# EAGLE design TQFP-100_to_breadboard-100 (EAGLE 8.5.1)
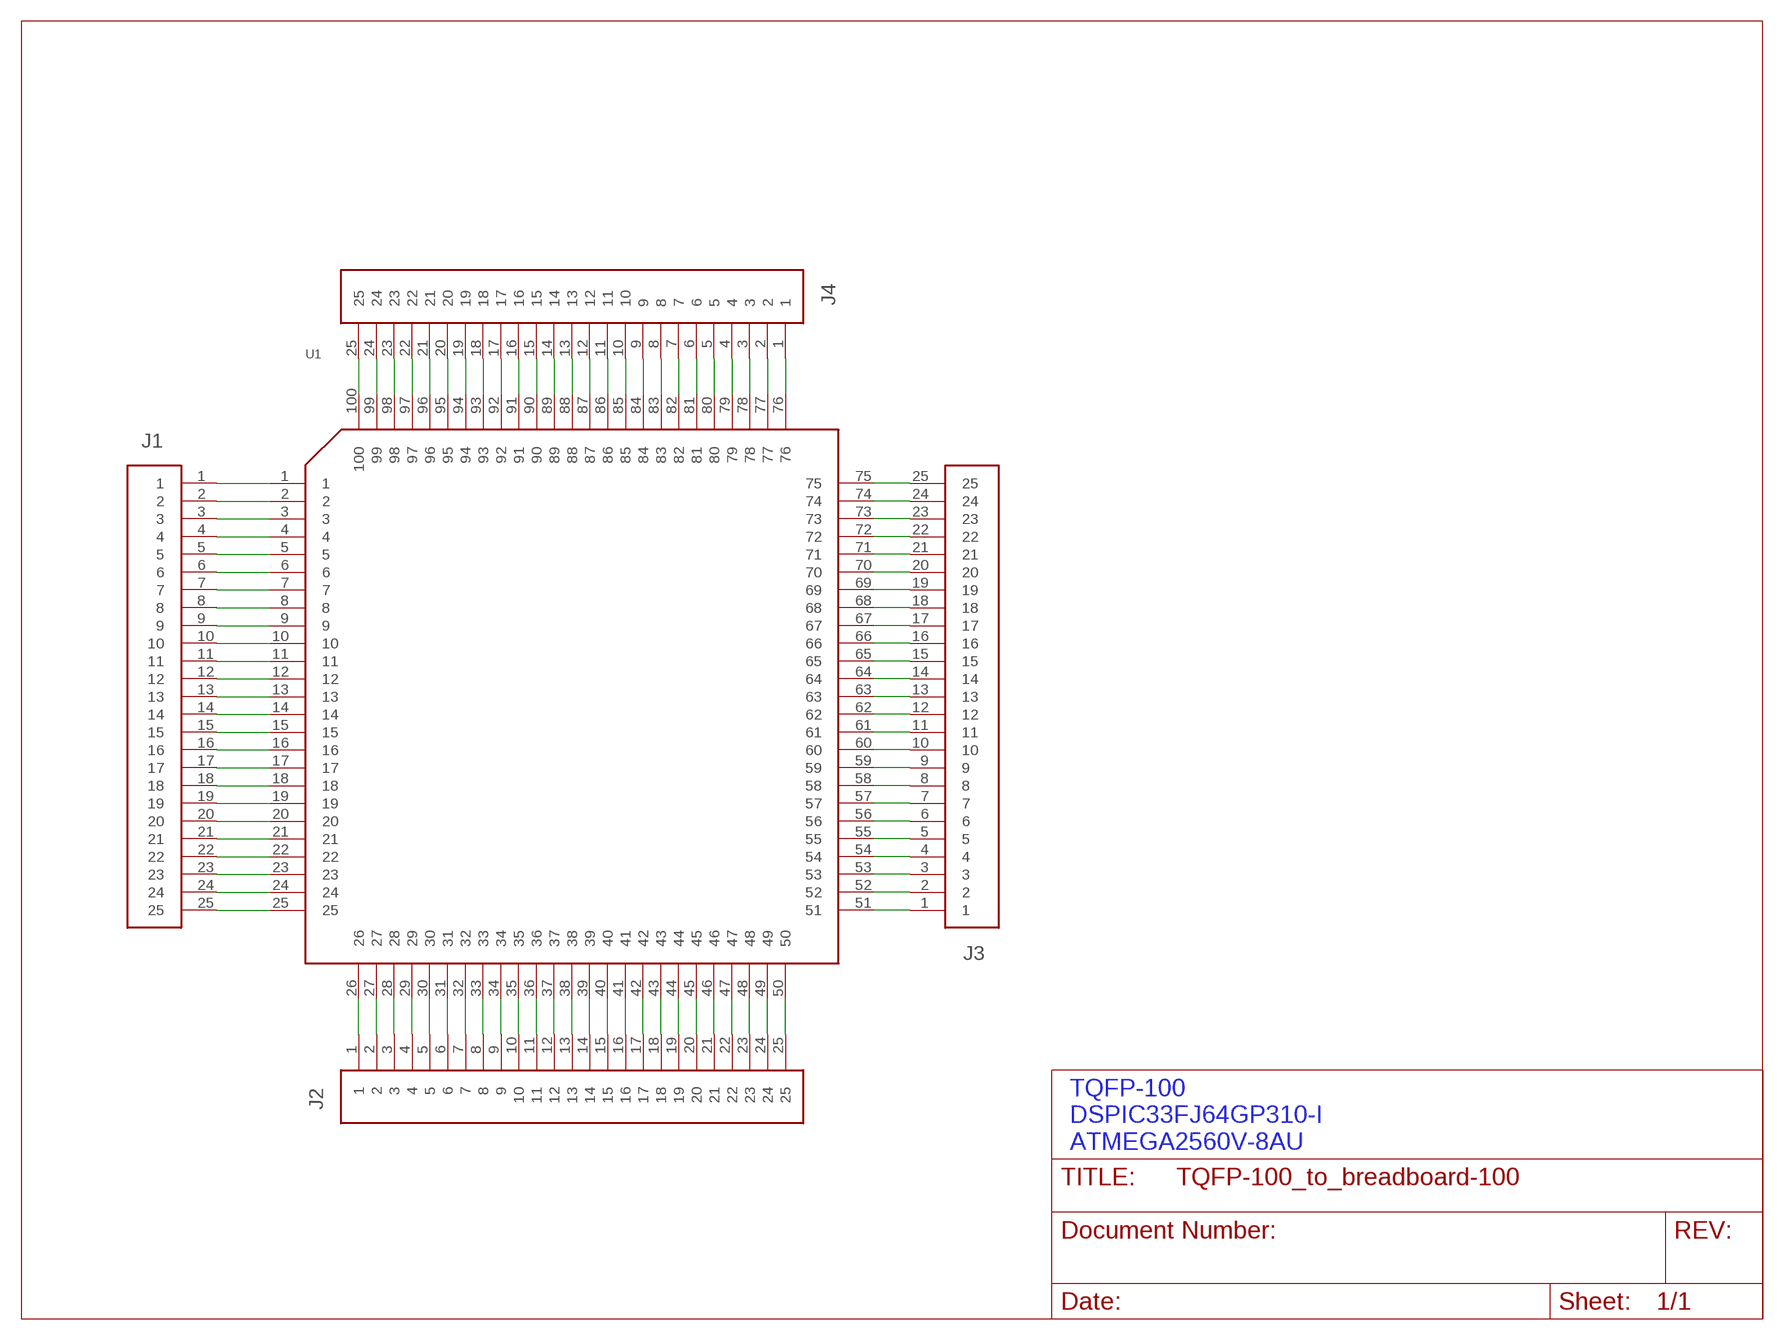
[diagram p0: schematic, sheet 1]

## Parts
J1  CONNECTOR_25  [68000-125HLF]
J2  CONNECTOR_25_NO_SQUARE  [68000-125HLF_NO_SQUARE]
J3  CONNECTOR_25_NO_SQUARE  [68000-125HLF_NO_SQUARE]
J4  CONNECTOR_25_NO_SQUARE  [68000-125HLF_NO_SQUARE]
U1  IC-GENERIC-100-TQFP  [QFP40P1400X1400X120-100N]

## Nets
N$1: J1.1 U1.1
N$2: J1.2 U1.2
N$3: J1.3 U1.3
N$4: J1.4 U1.4
N$5: J1.5 U1.5
N$6: J1.6 U1.6
N$7: J1.7 U1.7
N$8: J1.8 U1.8
N$9: J1.9 U1.9
N$10: J1.10 U1.10
N$11: J1.11 U1.11
N$12: J1.12 U1.12
N$13: J1.13 U1.13
N$14: J1.14 U1.14
N$15: J1.15 U1.15
N$16: J1.16 U1.16
N$17: J1.17 U1.17
N$18: J1.18 U1.18
N$19: J1.19 U1.19
N$20: J1.20 U1.20
N$21: J1.21 U1.21
N$22: J1.22 U1.22
N$23: J1.23 U1.23
N$24: J1.24 U1.24
N$25: J1.25 U1.25
N$26: J2.1 U1.26
N$27: J2.2 U1.27
N$28: J2.3 U1.28
N$29: J2.4 U1.29
N$30: J2.5 U1.30
N$31: J2.6 U1.31
N$32: J2.7 U1.32
N$33: J2.8 U1.33
N$34: J2.9 U1.34
N$35: J2.10 U1.35
N$36: J2.11 U1.36
N$37: J2.12 U1.37
N$38: J2.13 U1.38
N$39: J2.14 U1.39
N$40: J2.15 U1.40
N$41: J2.16 U1.41
N$42: J2.17 U1.42
N$43: J2.18 U1.43
N$44: J2.19 U1.44
N$45: J2.20 U1.45
N$46: J2.21 U1.46
N$47: J2.22 U1.47
N$48: J2.23 U1.48
N$49: J2.24 U1.49
N$50: J2.25 U1.50
N$51: J3.1 U1.51
N$52: J3.2 U1.52
N$53: J3.3 U1.53
N$54: J3.4 U1.54
N$55: J3.5 U1.55
N$56: J3.6 U1.56
N$57: J3.7 U1.57
N$58: J3.8 U1.58
N$59: J3.9 U1.59
N$60: J3.10 U1.60
N$61: J3.11 U1.61
N$62: J3.12 U1.62
N$63: J3.13 U1.63
N$64: J3.14 U1.64
N$65: J3.15 U1.65
N$66: J3.16 U1.66
N$67: J3.17 U1.67
N$68: J3.18 U1.68
N$69: J3.19 U1.69
N$70: J3.20 U1.70
N$71: J3.21 U1.71
N$72: J3.22 U1.72
N$73: J3.23 U1.73
N$74: J3.24 U1.74
N$75: J3.25 U1.75
N$76: J4.1 U1.76
N$77: J4.2 U1.77
N$78: J4.3 U1.78
N$79: J4.4 U1.79
N$80: J4.5 U1.80
N$81: J4.6 U1.81
N$82: J4.7 U1.82
N$83: J4.8 U1.83
N$84: J4.9 U1.84
N$85: J4.10 U1.85
N$86: J4.11 U1.86
N$87: J4.12 U1.87
N$88: J4.13 U1.88
N$89: J4.14 U1.89
N$90: J4.15 U1.90
N$91: J4.16 U1.91
N$92: J4.17 U1.92
N$93: J4.18 U1.93
N$94: J4.19 U1.94
N$95: J4.20 U1.95
N$96: J4.21 U1.96
N$97: J4.22 U1.97
N$98: J4.23 U1.98
N$99: J4.24 U1.99
N$100: J4.25 U1.100

## Notes on the sheet
- TQFP-100
  DSPIC33FJ64GP310-I
  ATMEGA2560V-8AU

## Library data of the parts
J1-J4 = SnapEDA:CONNECTOR_25
U1 = SnapEDA:IC-GENERIC-100

## Board
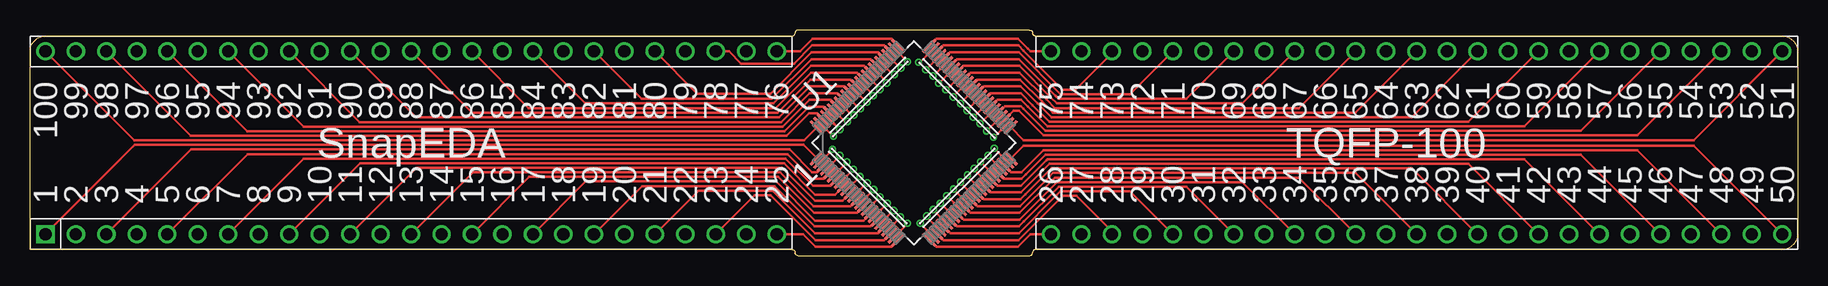
[diagram p1: board, top side]
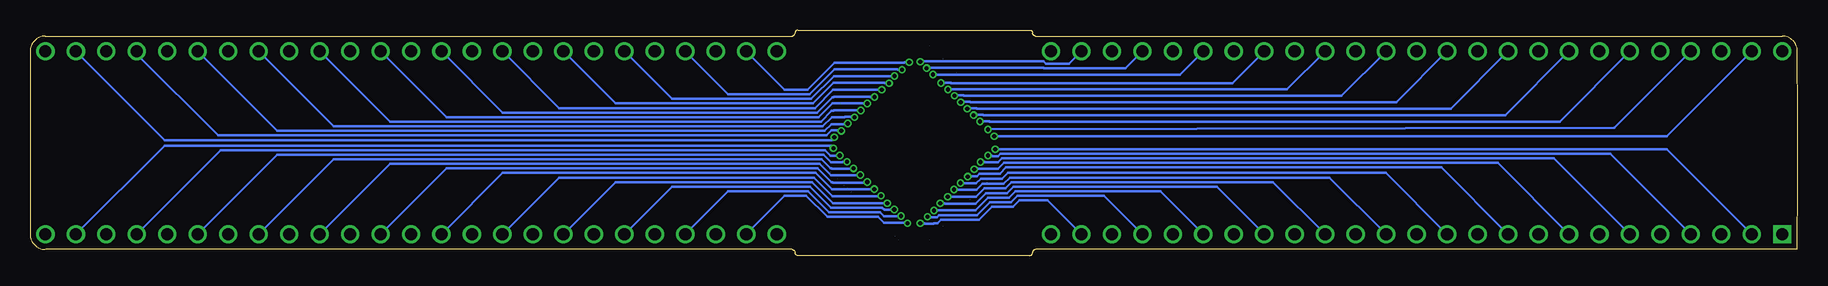
[diagram p2: board, bottom side, seen from below]

Size 147.35 x 18.8 mm. Coordinates in mm from the lower left corner, seen from the top.
Outline: 146.05,0.51 83.84,0.51 arc90 83.58,0.25 arc-90 83.33,0 64.02,0 arc-90 63.77,0.25 arc90 63.52,0.51 0.02,0.51 arc0 0.02,17.02 arc-90 1.29,18.29
Outline: 146.07,0.51 arc90 147.34,1.78 arc0 147.34,17.02 arc90 146.07,18.29 83.84,18.29 arc-90 83.58,18.54 arc90 83.33,18.8 64.02,18.8 arc90 63.77,18.54 arc-90 63.52,18.29 1.31,18.29
Copper layers (1*16): Top 0.035559375mm / dielectric 1.6mm / Bottom 0.035559375mm
Design rules "oshpark-2layer": minimum track width 6mil, minimum drill 10mil, track to track 6mil, track to pad 6mil, pad to pad 6mil, via to via 6mil, smd to smd 6mil, copper to edge 15mil, drill to drill 6mil, minimum pad ring 5mil, minimum via ring 5mil, stop-mask expansion 2.5mil, vias tented up to drill 0mil, thermal gap 10mil

### Footprints (pad centres in the part's own frame; a part is rotated, then mirrored left to right if it is on the bottom)
68000-125HLF = drill 1.016 square: 1 0,0 | drill 1.016: 2 2.54,0; 3 5.08,0; 4 7.62,0; 5 10.16,0; 6 12.7,0; 7 15.24,0; 8 17.78,0; 9 20.32,0; 10 22.86,0; 11 25.4,0; 12 27.94,0; 13 30.48,0; 14 33.02,0; 15 35.56,0; 16 38.1,0; 17 40.64,0; 18 43.18,0; 19 45.72,0; 20 48.26,0; 21 50.8,0; 22 53.34,0; 23 55.88,0; 24 58.42,0; 25 60.96,0
68000-125HLF_NO_SQUARE = drill 1.016: 1 0,0; 2 2.54,0; 3 5.08,0; 4 7.62,0; 5 10.16,0; 6 12.7,0; 7 15.24,0; 8 17.78,0; 9 20.32,0; 10 22.86,0; 11 25.4,0; 12 27.94,0; 13 30.48,0; 14 33.02,0; 15 35.56,0; 16 38.1,0; 17 40.64,0; 18 43.18,0; 19 45.72,0; 20 48.26,0; 21 50.8,0; 22 53.34,0; 23 55.88,0; 24 58.42,0; 25 60.96,0
QFP40P1400X1400X120-100N = smd 1.473 x 0.229: 1 -6.629,4.801; 2 -6.629,4.394; 3 -6.629,3.988; 4 -6.629,3.607; 5 -6.629,3.2; 6 -6.629,2.794; 7 -6.629,2.388; 8 -6.629,2.007; 9 -6.629,1.6; 10 -6.629,1.194; 11 -6.629,0.787; 12 -6.629,0.406; 13 -6.629,0; 14 -6.629,-0.406; 15 -6.629,-0.787; 16 -6.629,-1.194; 17 -6.629,-1.6; 18 -6.629,-2.007; 19 -6.629,-2.388; 20 -6.629,-2.794; 21 -6.629,-3.2; 22 -6.629,-3.607; 23 -6.629,-3.988; 24 -6.629,-4.394; 25 -6.629,-4.801; 51 6.629,-4.801; 52 6.629,-4.394; 53 6.629,-3.988; 54 6.629,-3.607; 55 6.629,-3.2; 56 6.629,-2.794; 57 6.629,-2.388; 58 6.629,-2.007; 59 6.629,-1.6; 60 6.629,-1.194; 61 6.629,-0.787; 62 6.629,-0.406; 63 6.629,0; 64 6.629,0.406; 65 6.629,0.787; 66 6.629,1.194; 67 6.629,1.6; 68 6.629,2.007; 69 6.629,2.388; 70 6.629,2.794; 71 6.629,3.2; 72 6.629,3.607; 73 6.629,3.988; 74 6.629,4.394; 75 6.629,4.801 | smd 0.229 x 1.473: 26 -4.801,-6.629; 27 -4.394,-6.629; 28 -3.988,-6.629; 29 -3.607,-6.629; 30 -3.2,-6.629; 31 -2.794,-6.629; 32 -2.388,-6.629; 33 -2.007,-6.629; 34 -1.6,-6.629; 35 -1.194,-6.629; 36 -0.787,-6.629; 37 -0.406,-6.629; 38 0,-6.629; 39 0.406,-6.629; 40 0.787,-6.629; 41 1.194,-6.629; 42 1.6,-6.629; 43 2.007,-6.629; 44 2.388,-6.629; 45 2.794,-6.629; 46 3.2,-6.629; 47 3.607,-6.629; 48 3.988,-6.629; 49 4.394,-6.629; 50 4.801,-6.629; 76 4.801,6.629; 77 4.394,6.629; 78 3.988,6.629; 79 3.607,6.629; 80 3.2,6.629; 81 2.794,6.629; 82 2.388,6.629; 83 2.007,6.629; 84 1.6,6.629; 85 1.194,6.629; 86 0.787,6.629; 87 0.406,6.629; 88 0,6.629; 89 -0.406,6.629; 90 -0.787,6.629; 91 -1.194,6.629; 92 -1.6,6.629; 93 -2.007,6.629; 94 -2.388,6.629; 95 -2.794,6.629; 96 -3.2,6.629; 97 -3.607,6.629; 98 -3.988,6.629; 99 -4.394,6.629; 100 -4.801,6.629

### Placement (x,y rotation side)
J1  1.29,1.78 0 top
J2  85.11,1.78 0 top
J3  146.07,17.02 180 top
J4  62.25,17.02 180 top
U1  73.68,9.4 45 top

### Tracks (layer width: path | path; a pad name or v marks a point on that pad's centre or on a via)
N$1
  Top 0.229: J1.1 8.73,9.22 64.48,9.22 U1.1
N$2  (via drill 0.35)
  Top 0.229: U1.2 66.89,8.83 v66.89,8.87
  Bottom 0.229: v66.89,8.87 10.91,8.87 J1.2
N$3
  Top 0.229: J1.3 13.43,8.84 63.31,8.84 65.2,6.95 65.59,6.95 U1.3
N$4  (via drill 0.35)
  Top 0.229: U1.4 v67.5,8.33
  Bottom 0.229: v67.5,8.33 67.16,8.33 67.13,8.3 66.66,8.3 66.47,8.48 15.61,8.48 J1.4
N$5
  Top 0.229: J1.5 18.13,8.46 63.15,8.46 65.22,6.39 66.14,6.39 U1.5
N$6  (via drill 0.35)
  Top 0.229: U1.6 68.11,7.79 v68.11,7.8
  Bottom 0.229: J1.6 20.31,8.1 66.31,8.1 66.65,7.76 67.74,7.76 67.77,7.8 v68.11,7.8
N$7
  Top 0.229: J1.7 22.82,8.08 63,8.08 65.26,5.82 66.72,5.82 U1.7
N$8  (via drill 0.35)  (1 unrouted)
  Top 0.229: U1.8 68.63,7.19 v68.65,7.19
  Bottom 0.229: v68.65,7.19 68.61,7.23 66.65,7.23 66.15,7.72 25.01,7.72 J1.8
N$9
  Top 0.229: U1.9 67.09,5.08 65.46,5.08 62.84,7.7 27.52,7.7 J1.9
N$10  (via drill 0.35)
  Top 0.229: U1.10 v69.18,6.58
  Bottom 0.229: v69.18,6.58 69.14,6.62 68.41,6.62 68.22,6.81 66.51,6.81 65.98,7.34 29.71,7.34 J1.10
N$11
  Top 0.229: J1.11 32.22,7.32 62.68,7.32 65.42,4.57 67.74,4.57 U1.11
N$12  (via drill 0.35)
  Top 0.229: U1.12 69.75,6.04 v69.79,6.04
  Bottom 0.229: v69.79,6.04 69.45,6.04 69.42,6.01 68.48,6.01 68.09,6.4 66.31,6.4 65.83,6.88 34.33,6.88 J1.12
N$13  (1 unrouted)
  Top 0.229: J1.13 36.92,6.93 62.52,6.93 65.32,4.13 68.41,4.13 U1.13
N$14  (via drill 0.35)
  Top 0.229: U1.14 70.32,5.47 v70.32,5.51
  Bottom 0.229: v70.32,5.51 70.06,5.51 70.02,5.48 68.45,5.48 67.96,5.97 66.21,5.97 65.67,6.5 39.03,6.5 J1.14
N$15
  Top 0.229: J1.15 41.62,6.55 62.36,6.55 65.36,3.56 68.72,3.56 68.95,3.56 U1.15
N$16  (via drill 0.35)
  Top 0.229: U1.16 v70.86,4.89 v70.86,4.9
  Bottom 0.229: v70.86,4.9 68.49,4.9 67.8,5.59 66.05,5.59 65.52,6.12 43.73,6.12 J1.16
N$17
  Top 0.229: J1.17 46.32,6.17 62.2,6.17 65.46,2.92 69.46,2.92 U1.17
N$18  (via drill 0.35)
  Top 0.229: U1.18 71.47,4.35 v71.47,4.37
  Bottom 0.229: v71.47,4.37 71.13,4.37 71.09,4.33 68.52,4.33 67.64,5.21 65.89,5.21 65.36,5.74 48.43,5.74 J1.18
N$19
  Top 0.229: J1.19 51.02,5.79 62.05,5.79 65.41,2.42 70.08,2.42 U1.19
N$20  (via drill 0.35)
  Top 0.229: U1.20 v71.99,3.76 v72,3.76
  Bottom 0.229: v72,3.76 68.55,3.76 67.49,4.83 65.73,4.83 65.2,5.36 53.13,5.36 J1.20
N$21  (1 unrouted)
  Top 0.229: J1.21 55.72,5.41 61.89,5.41 65.44,1.85 68.42,1.85 68.43,1.87 70.67,1.87 U1.21
N$22  (via drill 0.35)
  Top 0.229: U1.22 72.53,3.16 v72.53,3.22
  Bottom 0.229: v72.53,3.22 72.27,3.22 72.23,3.19 71.76,3.19 71.58,3.38 68.4,3.38 67.33,4.45 65.58,4.45 65.04,4.98 57.83,4.98 J1.22
N$23
  Top 0.229: J1.23 60.42,5.03 61.73,5.03 65.47,1.29 71.21,1.29 U1.23
N$24  (via drill 0.35)
  Top 0.229: U1.24 73.14,2.65 v73.14,2.69
  Bottom 0.229: v73.14,2.69 72.81,2.69 72.77,2.66 72.04,2.66 72,2.69 71.72,2.69 71.42,3 68.24,3 67.17,4.06 65.42,4.06 64.89,4.6 62.52,4.6 J1.24
N$25  (1 unrouted)
  Top 0.229: J1.25 64.44,1.78 65.49,0.73 71.8,0.73 U1.25
N$26  (1 unrouted)
  Top 0.229: J2.1 83.41,1.78 82.37,0.73 75.55,0.73 U1.26
N$27  (via drill 0.35)  (1 unrouted)
  Top 0.229: U1.27 74.21,2.65 v74.21,2.69
  Bottom 0.229: v74.21,2.69 74.25,2.73 76.16,2.73 76.65,3.23 80.89,3.23 82.64,4.98 84.45,4.98 J2.2
N$28
  Top 0.229: U1.28 76.14,1.29 82.39,1.29 85.72,4.62 | 85.72,4.62 | 85.72,4.62 86.07,4.98 87.24,4.98 90.19,2.03 J2.3
N$29  (via drill 0.35)
  Top 0.229: U1.29 74.74,3.23 v74.74,3.3
  Bottom 0.229: v74.74,3.3 75,3.3 75.04,3.27 76.15,3.27 76.49,3.61 80.73,3.61 82.48,5.36 89.14,5.36 J2.4
N$30
  Top 0.229: U1.30 76.14,2.45 76.72,1.87 82.42,1.87 85.56,5.01 | 85.56,5.01 | 85.56,5.01 85.92,5.36 91.68,5.36 J2.5
N$31  (via drill 0.35)
  Top 0.229: U1.31 75.29,3.83 v75.3,3.83
  Bottom 0.229: v75.3,3.83 75.61,3.83 75.65,3.8 76.12,3.8 76.31,3.99 80.57,3.99 82.33,5.74 93.84,5.74 J2.6
N$32
  Top 0.229: U1.32 77.27,2.42 82.44,2.42 82.86,2.84 | 82.86,2.84 | 82.86,2.84 85.76,5.74 96.38,5.74 J2.7
N$33  (via drill 0.35)
  Top 0.229: U1.33 75.89,4.35 v75.89,4.37
  Bottom 0.229: v75.89,4.37 80.42,4.37 82.17,6.12 98.54,6.12 J2.8
N$34
  Top 0.229: U1.34 77.27,3.58 77.85,3 82.48,3 85.6,6.12 101.08,6.12 J2.9
N$35  (via drill 0.35)
  Top 0.229: U1.35 76.42,4.97 v76.42,4.98
  Bottom 0.229: v76.42,4.98 76.68,4.98 76.72,4.94 80.45,4.94 82.01,6.5 103.24,6.5 J2.10
N$36
  Top 0.229: U1.36 78.41,3.56 82.5,3.56 85.26,6.32 | 85.26,6.32 | 85.26,6.32 85.44,6.5 105.78,6.5 J2.11
N$37  (via drill 0.35)
  Top 0.229: U1.37 76.99,5.51 v76.98,5.54
  Bottom 0.229: v76.98,5.54 80.48,5.51 81.85,6.88 107.94,6.88 J2.12
N$38
  Top 0.229: U1.38 78.4,4.71 78.98,4.13 82.53,4.13 84.88,6.47 | 84.88,6.47 | 84.88,6.47 85.29,6.88 110.48,6.88 J2.13
N$39  (via drill 0.35)
  Top 0.229: U1.39 77.56,6.09 v77.56,6.12
  Bottom 0.229: v77.56,6.12 77.82,6.12 77.86,6.09 80.42,6.09 80.46,6.12 80.55,6.12 81.69,7.26 112.64,7.26 J2.14
N$40  (1 unrouted)
  Top 0.229: 82.97,5.1 | 82.97,5.1 82.55,4.69 79.5,4.69 U1.40 | 82.97,5.1 85.13,7.26 115.18,7.26 J2.15
N$41  (via drill 0.35)  (1 unrouted)
  Top 0.229: U1.41 78.11,6.66 v78.15,6.71
  Bottom 0.229: v78.15,6.71 78.14,6.7 80.59,6.7 81.54,7.64 117.34,7.64 J2.16
N$42  (1 unrouted)
  Top 0.229: J2.17 119.88,7.64 84.97,7.64 82.58,5.26 80.08,5.26 U1.42
N$43  (via drill 0.35)
  Top 0.229: U1.43 78.7,7.21 v78.7,7.26
  Bottom 0.229: v78.7,7.26 78.89,7.26 78.93,7.23 80.5,7.23 80.53,7.26 80.62,7.26 81.38,8.03 122.04,8.03 J2.18
N$44  (1 unrouted)
  Top 0.229: 84.72,7.94 | 84.72,7.94 82.6,5.82 80.63,5.82 U1.44 | 84.72,7.94 84.81,8.03 124.58,8.03 J2.19
N$45  (via drill 0.35)
  Top 0.229: U1.45 79.23,7.8 v79.24,7.82
  Bottom 0.229: v79.24,7.82 79.58,7.8 79.61,7.76 80.58,7.76 81.22,8.41 126.74,8.41 J2.20
N$46  (1 unrouted)
  Top 0.229: 83.04,6.79 | 83.04,6.79 82.64,6.39 81.21,6.39 U1.46 | 83.04,6.79 84.65,8.41 129.28,8.41 J2.21
N$47  (via drill 0.35)
  Top 0.229: U1.47 v79.85,8.33
  Bottom 0.229: v79.85,8.33 80.61,8.33 81.06,8.79 131.44,8.79 J2.22
N$48  (1 unrouted)
  Top 0.229: J2.23 133.98,8.79 84.5,8.79 82.66,6.95 81.76,6.95 U1.48
N$49  (via drill 0.35)
  Top 0.229: U1.49 80.38,8.91 v80.38,8.94
  Bottom 0.229: v80.38,8.94 arc-90 80.61,9.17 136.13,9.17 J2.24
N$50
  Top 0.229: U1.50 82.82,9.17 138.67,9.17 J2.25
N$51
  Top 0.229: U1.51 82.82,9.63 138.67,9.63 J3.1
N$52  (via drill 0.35)
  Top 0.229: U1.52 80.35,9.86 v80.3,9.86
  Bottom 0.229: v80.3,9.86 80.53,9.63 136.13,9.63 J3.2
N$53
  Top 0.229: U1.53 81.98,12.06 82.44,12.06 84.5,10.01 133.98,10.01 J3.3
N$54  (via drill 0.35)
  Top 0.229: U1.54 79.77,10.39 v79.72,10.39
  Bottom 0.229: v79.72,10.39 80.03,10.39 80.07,10.42 80.54,10.42 80.96,10.01 131.66,10.01 138.45,16.79 J3.4
N$55
  Top 0.229: U1.55 80.66,11.82 81.29,12.45 82.6,12.45 82.82,12.22 | 82.82,12.22 | 82.82,12.22 84.65,10.39 129.28,10.39 J3.5
N$56  (via drill 0.35)
  Top 0.229: U1.56 79.24,11.01 v79.19,11
  Bottom 0.229: v79.19,11 79.5,10.92 79.54,10.96 80.55,10.96 81.11,10.39 126.74,10.39 J3.6
N$57
  Top 0.229: 83.2,12.38 | 83.2,12.38 82.6,12.98 80.63,12.98 U1.57 | 83.2,12.38 84.81,10.77 124.58,10.77 J3.7
N$58  (via drill 0.35)  (1 unrouted)
  Top 0.229: v78.63,11.53 78.65,11.53 79.67,12.55 | U1.58 79.67,12.55 | 79.67,12.55
  Bottom 0.229: J3.8 122.04,10.77 81.27,10.77 80.51,11.53 79.46,11.53 79.42,11.57 78.95,11.57 78.92,11.53 v78.63,11.53
N$59
  Top 0.229: 83.58,12.54 | 83.58,12.54 82.58,13.54 80.71,13.54 80.57,13.54 80.08,13.54 U1.59 | 83.58,12.54 84.97,11.15 119.88,11.15 J3.9
N$60  (via drill 0.35)
  Top 0.229: U1.60 78.1,12.13 v78.1,12.09
  Bottom 0.229: v78.1,12.09 78.36,12.06 78.39,12.1 80.35,12.1 80.38,12.06 80.52,12.06 81.43,11.15 117.34,11.15 J3.10
N$61
  Top 0.229: 83.96,12.7 | 83.96,12.7 82.55,14.11 79.5,14.11 U1.61 | 83.96,12.7 85.13,11.53 115.18,11.53 J3.11
N$62  (via drill 0.35)
  Top 0.229: U1.62 77.56,12.71 v77.56,12.68
  Bottom 0.229: v77.56,12.68 80.46,12.68 81.6,11.53 112.64,11.53 J3.12
N$63
  Top 0.229: 84.34,12.85 | 84.34,12.85 82.53,14.67 78.94,14.67 U1.63 | 84.34,12.85 85.29,11.91 110.48,11.91 J3.13
N$64  (via drill 0.35)
  Top 0.229: U1.64 76.95,13.25 v76.95,13.21
  Bottom 0.229: v76.95,13.21 77.29,13.21 77.33,13.24 80.35,13.24 80.38,13.21 80.46,13.21 81.76,11.91 107.94,11.91 J3.14
N$65
  Top 0.229: U1.65 78.41,15.24 82.5,15.24 84.72,13.01 | 84.72,13.01 | 84.72,13.01 85.44,12.29 105.78,12.29 J3.15
N$66  (via drill 0.35)
  Top 0.229: U1.66 76.41,13.82 v76.34,13.82
  Bottom 0.229: v76.34,13.82 80.39,13.82 81.92,12.29 103.24,12.29 J3.16
N$67
  Top 0.229: 85.11,13.17 | 85.11,13.17 82.48,15.8 77.81,15.8 U1.67 | 85.11,13.17 85.6,12.68 101.08,12.68 J3.17
N$68  (via drill 0.35)
  Top 0.229: U1.68 75.79,14.35 v75.73,14.35
  Bottom 0.229: v75.73,14.35 76.07,14.35 76.11,14.39 80.36,14.39 82.07,12.68 98.54,12.68 J3.18
N$69
  Top 0.229: U1.69 77.27,16.37 82.44,16.37 85.49,13.33 | 85.49,13.33 | 85.49,13.33 85.76,13.06 96.38,13.06 J3.19
N$70  (via drill 0.35)
  Top 0.229: U1.70 75.29,14.96 v75.28,14.96
  Bottom 0.229: v75.28,14.96 80.33,14.96 82.23,13.06 93.84,13.06 J3.20
N$71
  Top 0.229: J3.21 91.68,13.44 85.92,13.44 82.42,16.93 77.36,16.93 76.72,16.93 76.68,16.93 U1.71
N$72  (via drill 0.35)
  Top 0.229: U1.72 v74.67,15.49
  Bottom 0.229: v74.67,15.49 75,15.49 75.04,15.53 80.3,15.53 82.39,13.44 89.14,13.44 J3.22
N$73
  Top 0.229: U1.73 76.14,17.5 82.39,17.5 82.8,17.09 | 82.8,17.09 | 82.8,17.09 86.07,13.82 87.16,13.82 90.19,16.84 J3.23
N$74  (via drill 0.35)
  Top 0.229: U1.74 74.13,16.07 v74.06,16.1
  Bottom 0.229: J3.24 84.45,13.82 82.55,13.82 80.3,16.06 74.51,16.06 74.47,16.1 v74.06,16.1
N$75
  Top 0.229: 83.19,17.25 | 83.19,17.25 82.37,18.06 76.52,18.06 76.35,18.06 75.55,18.06 U1.75 | J3.25 83.41,17.02 83.19,17.25
N$76  (1 unrouted)
  Top 0.229: J4.1 64.17,17.02 65.21,18.06 71.49,18.06 71.54,18.06 71.8,18.06 U1.76
N$77  (via drill 0.35)
  Top 0.229: U1.77 73.13,16.15 v73.14,16.15
  Bottom 0.229: v73.14,16.15 72.88,16.15 72.84,16.19 62.87,16.19 62.67,15.99 60.73,15.99 J4.2
N$78
  Top 0.229: J4.3 58.25,17.02 59.28,15.99 63.68,15.99 65.19,17.5 71.21,17.5 U1.78
N$79  (via drill 0.35)
  Top 0.229: U1.79 72.55,15.62 v72.61,15.62
  Bottom 0.229: J4.4 56.04,15.61 62.83,15.61 62.87,15.65 72.31,15.65 72.34,15.62 v72.61,15.62
N$80  (1 unrouted)
  Top 0.229: J4.5 55.62,13.49 61.71,13.49 65.16,16.93 70.67,16.93 U1.80
N$81  (via drill 0.35)
  Top 0.229: U1.81 71.94,15.09 v72.07,15.09
  Bottom 0.229: v72.07,15.09 70.37,15.09 70.22,15.09 51.48,15.09 J4.6
N$82
  Top 0.229: J4.7 50.97,13.06 61.82,13.06 65.14,16.37 70.08,16.37 U1.82
N$83  (via drill 0.35)
  Top 0.229: U1.83 71.53,14.38 v71.41,14.38
  Bottom 0.229: J4.8 47.11,14.38 70.56,14.38 70.6,14.41 71.07,14.41 71.1,14.38 v71.41,14.38
N$84  (1 unrouted)
  Top 0.229: J4.9 46.27,12.68 61.98,12.68 65.1,15.8 69.54,15.8 U1.84
N$85  (via drill 0.35)
  Top 0.229: U1.85 70.83,13.93 v70.83,13.84
  Bottom 0.229: J4.10 42.56,13.84 70.03,13.84 70.06,13.88 70.53,13.88 70.57,13.84 v70.83,13.84
N$86
  Top 0.229: J4.11 41.57,12.29 62.14,12.29 65.08,15.24 68.95,15.24 U1.86
N$87  (via drill 0.35)
  Top 0.229: U1.87 70.3,13.35 v70.3,13.31
  Bottom 0.229: J4.12 38.02,13.31 69.49,13.31 69.53,13.34 70,13.34 70.03,13.31 v70.3,13.31
N$88
  Top 0.229: J4.13 36.87,11.91 62.29,11.91 65.05,14.67 68.41,14.67 U1.88
N$89  (via drill 0.35)
  Top 0.229: U1.89 69.73,12.77 v69.76,12.77
  Bottom 0.229: J4.14 33.47,12.77 68.96,12.77 68.99,12.81 69.46,12.81 69.5,12.77 v69.76,12.77
N$90
  Top 0.229: J4.15 32.17,11.53 62.45,11.53 65.03,14.11 67.85,14.11 U1.90
N$91  (via drill 0.35)
  Top 0.229: U1.91 69.15,12.24 v69.23,12.24
  Bottom 0.229: J4.16 28.93,12.24 68.42,12.24 68.46,12.27 68.93,12.27 68.96,12.24 v69.23,12.24
N$92
  Top 0.229: J4.17 27.5,11.12 62.58,11.12 64.99,13.54 67.28,13.54 U1.92
N$93  (via drill 0.35)
  Top 0.229: v68.69,11.7 68.53,11.7 67.68,12.55 | U1.93 67.68,12.55 | 67.68,12.55
  Bottom 0.229: J4.18 24.38,11.7 67.89,11.7 67.92,11.74 68.39,11.74 68.43,11.7 v68.69,11.7
N$94
  Top 0.229: J4.19 22.8,10.74 62.74,10.74 64.98,12.98 66.72,12.98 U1.94
N$95  (via drill 0.35)
  Top 0.229: v68.16,11.17 67.95,11.17 U1.95
  Bottom 0.229: J4.20 19.83,11.17 67.35,11.17 67.39,11.2 67.86,11.2 67.89,11.17 v68.16,11.17
N$96
  Top 0.229: J4.21 18.1,10.36 62.9,10.36 64.94,12.4 66.14,12.4 U1.96
N$97  (via drill 0.35)
  Top 0.229: v67.49,10.51 67.34,10.63 67.05,10.92 | 67.05,10.92 66.77,11.2 | 67.05,10.92 | U1.97 67.05,10.92
  Bottom 0.229: J4.22 15.29,10.63 v67.49,10.51
N$98
  Top 0.229: J4.23 13.4,9.98 63.06,9.98 64.92,11.85 65.59,11.85 U1.98
N$99  (via drill 0.35)
  Top 0.229: U1.99 66.93,9.93 v66.97,9.93
  Bottom 0.229: J4.24 10.91,9.93 v66.97,9.93
N$100
  Top 0.229: J4.25 8.7,9.6 64.5,9.6 U1.100

### Text on the board
tPlace: 100 | 99 | 98 | 97 | 96 | 95 | 94 | 93 | 92 | 91 | 90 | 89 | 88 | 87 | 86 | 85 | 84 | 83 | 82 | 81 | 80 | 79 | 78 | 77 | 76 | 75 | 74 | 73 | 72 | 71 | 70 | 69 | 68 | 67 | 66 | 65 | 64 | 63 | 62 | 61 | 60 | 59 | 58 | 57 | 56 | 55 | 54 | 53 | 52 | 51 | SnapEDA | TQFP-100 | 1 | 1 | 2 | 3 | 4 | 5 | 6 | 7 | 8 | 9 | 10 | 11 | 12 | 13 | 14 | 15 | 16 | 17 | 18 | 19 | 20 | 21 | 22 | 23 | 24 | 25 | 26 | 27 | 28 | 29 | 30 | 31 | 32 | 33 | 34 | 35 | 36 | 37 | 38 | 39 | 40 | 41 | 42 | 43 | 44 | 45 | 46 | 47 | 48 | 49 | 50